# EasyEDA Pro project ProPrj_Quadcopter_2024-12-10.epro, board Quadcopter3.2
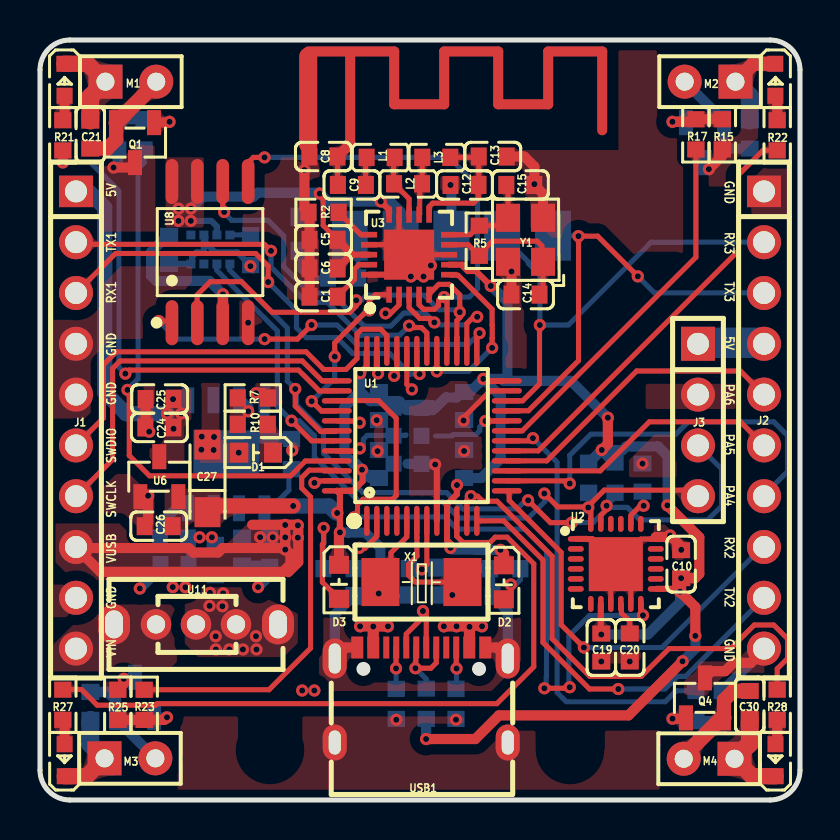
[diagram p7: board, top side]
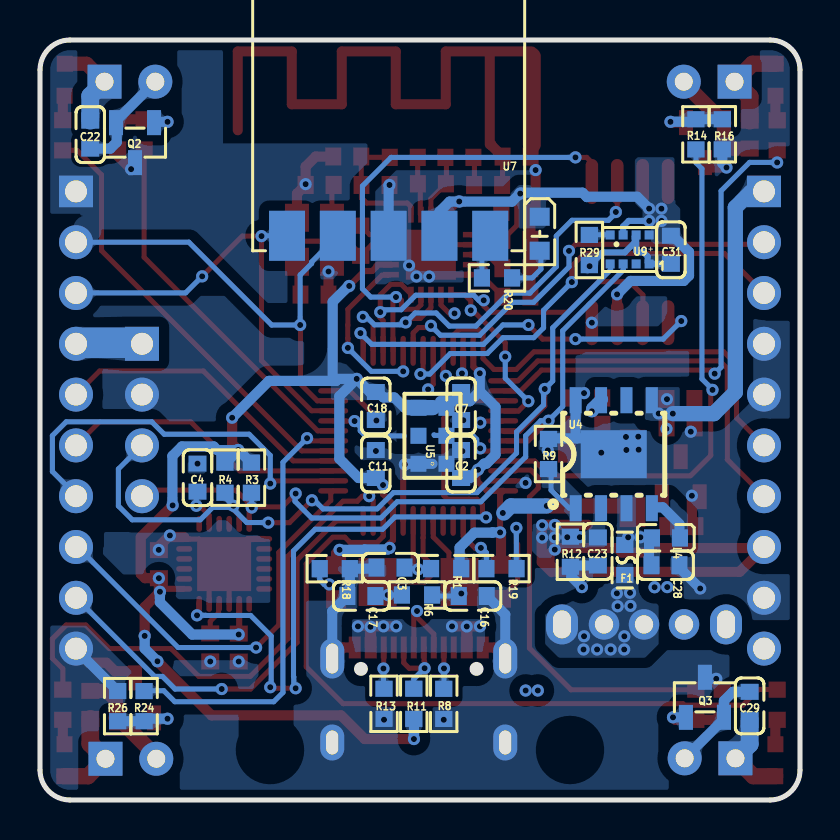
[diagram p8: board, bottom side, seen from below]

Outline 38 x 38 mm; copper layers: Top Layer, VCC, GND, Bottom Layer. Coordinates in mm from the lower left corner of the outline.
Outline path: 0,36.5 0,1.5 arc(0.44,0.44) 1.5,0 36.5,0 arc(37.56,0.44) 38,1.5 38,36.5 arc(37.56,37.56) 36.5,38 1.5,38 arc(0.44,37.56) 0,36.5
Stack: Top Layer 0.035mm 外层铜厚1oz / Dielectric1 0.2104mm 7628 RC49% 8.6mil / VCC 0.035mm / Dielectric4 0.48mm PP er 4.5 / GND 0.035mm / Dielectric5 0.48mm PP er 4.5 / Bottom Layer 0.035mm 外层铜厚1oz

## Design rules (mm)
template: 自定义配置
spacing copperThickness1oz (default): track to track 0.203, other pairs 0.203 to 0.203
spacing copperThickness2oz: track to track 0.203, other pairs 0.152 to 0.3
track width copperThickness1oz (default): min 0.254, default 0.254, max 0.762
track width copperThickness2oz: min 0.203, default 0.254, max 2.54
track width VCC GND: min 0.254, default 0.508, max 1.524
differential pair differentialPair (default): width min 0.127, default 0.254, max 2.54; gap min 0.152, default 0.152
via viaSize (default): diameter min 0.5, default 0.61, max 10; hole min 0.3, default 0.305, max 6.299
net GND uses VCC GND
net 3.3V uses VCC GND
net 5V uses VCC GND
net VBAT uses VCC GND
net VIN uses VCC GND
net VUSB uses VCC GND

## Placement (name value [footprint] x y rotation side)
C1  33nF  [C0603]  14.18 25.17 0 top
C2  100nF  [C0603]  16.95 16.8 90 bottom
C3  100nF  [C0603]  20.48 11.62 0 bottom
C4  2.2nF  [C0603]  30.12 16.12 90 bottom
C5  4.7uF  [C0603]  14.18 28.01 0 top
C6  100nF  [C0603]  14.18 26.59 0 top
C7  100nF  [C0603]  16.94 19.7 270 bottom
C8  1pF  [C0603]  14.17 32.17 180 top
C9  1.5pF  [C0603]  15.6 30.75 0 top
C10  100nF  [C0603]  32.06 11.79 90 top
C11  100nF  [C0603]  21.21 16.8 270 bottom
C12  2.2nF  [C0603]  21.22 30.75 180 top
C13  4.7pF  [C0603]  22.64 32.17 180 top
C14  22pF  [C0603]  24.28 25.27 0 top
C15  22pF  [C0603]  24.02 30.75 0 top
C16  22pF  [C0603]  16.36 10.2 180 bottom
C17  22pF  [C0603]  21.93 10.2 180 bottom
C18  100nF  [C0603]  21.21 19.7 90 bottom
C19  10nF  [C0603]  28.06 7.62 90 top
C20  100nF  [C0603]  29.49 7.63 90 top
C21  4.7uF  [C0603]  2.51 33.27 270 top
C22  4.7uF  [C0603]  35.49 33.27 270 bottom
C23  10uF  [C0603]  10.11 12.42 90 bottom
C24  20uF  [C0603]  5.97 18.63 180 top
C25  1uF  [C0603]  5.98 20.05 0 top
C26  1uF  [C0603]  5.94 13.69 0 top
C27  47uF  [CAP-SMD_L3.2-W1.6-RD]  8.37 16.08 90 top
C28  22uF  [C0603]  6.73 11.74 0 bottom
C29  4.7uF  [C0603]  2.52 4.71 90 bottom
C30  4.7uF  [C0603]  35.49 4.75 90 top
C31  100nF  [C0603]  6.46 27.51 270 bottom
D1  NCD0603G1  [LED0603-RD_1]  10.8 17.37 180 top
D2  NCD0603G1  [LED0603-RD_1]  23.19 10.89 270 top
D3  NCD0603G1  [LED0603-RD_1]  14.95 10.91 270 top
D4  NCD0603G1  [LED0603-RD_1]  13.02 28.31 270 bottom
D5  NCD0603R1  [LED0603-RD_RED]  1.22 36.01 270 top
D6  NCD0603R1  [LED0603-RD_RED]  36.77 36.01 270 top
D7  NCD0603R1  [LED0603-RD_RED]  1.24 1.99 90 top
D8  NCD0603R1  [LED0603-RD_RED]  36.78 1.99 90 top
F1  BSMD0603-050-6V  [F0603]  8.76 12 90 bottom
J1  PZ254V-11-10P  [HDR-TH_10P-P2.54-V-M]  1.8 19 270 top
J2  PZ254V-11-10P  [HDR-TH_10P-P2.54-V-M]  36.2 19 270 top
J3  PZ254V-11-04P  [HDR-TH_4P-P2.54-V-M]  32.9 19 270 top
L1  3.9nH  [L0603]  17.03 32.13 180 top
L2  8.2nH  [L0603]  18.4 30.81 180 top
L3  2.7nH  [L0603]  19.81 32.13 180 top
L4  2.2uH  [L0603]  6.7 13.1 180 bottom
M1  720  [HDR2.54-LI-2P]  4.54 35.92 0 top
M2  720  [HDR2.54-LI-2P]  33.5 35.92 180 top
M3  720  [HDR2.54-LI-2P]  4.5 2.08 0 top
M4  720  [HDR2.54-LI-2P]  33.46 2.06 180 top
Q1  SI2302  [SOT-23-3_L2.9-W1.3-P1.90-LS2.4-BR]  4.75 32.87 90 top
Q2  SI2302  [SOT-23-3_L2.9-W1.3-P1.90-LS2.4-BR]  33.25 32.87 90 bottom
Q3  SI2302  [SOT-23-3_L2.9-W1.3-P1.90-LS2.4-BR]  4.75 5.13 270 bottom
Q4  SI2302  [SOT-23-3_L2.9-W1.3-P1.90-LS2.4-BR]  33.25 5.11 270 top
R1  10kΩ  [R0603]  17.69 11.57 180 bottom
R2  22kΩ  [R0603]  14.18 29.38 180 top
R3  10kΩ  [R0603]  27.43 16.12 90 bottom
R4  10kΩ  [R0603]  28.75 16.12 90 bottom
R5  1MΩ  [R0603]  21.97 27.96 90 top
R6  1MΩ  [R0603]  19.15 10.25 0 bottom
R7  10kΩ  [R0603]  10.64 20.1 0 top
R8  5.1kΩ  [R0603]  17.81 4.81 270 bottom
R9  100kΩ  [R0603]  12.57 17.3 90 bottom
R10  3kΩ  [R0603]  10.64 18.78 180 top
R11  1.5kΩ  [R0603]  19.31 4.81 90 bottom
R12  1kΩ  [R0603]  11.48 12.41 90 bottom
R13  5.1kΩ  [R0603]  20.8 4.81 270 bottom
R14  100Ω  [R0603]  5.2 33.28 270 bottom
R15  100Ω  [R0603]  32.79 33.28 270 top
R16  10kΩ  [R0603]  3.88 33.28 90 bottom
R17  10kΩ  [R0603]  34.12 33.28 90 top
R18  1kΩ  [R0603]  23.26 11.57 0 bottom
R19  1kΩ  [R0603]  14.93 11.57 180 bottom
R20  1kΩ  [R0603]  15.15 26.1 180 bottom
R21  1kΩ  [R0603]  1.14 33.23 270 top
R22  1kΩ  [R0603]  36.86 33.24 270 top
R23  100Ω  [R0603]  5.21 4.76 90 top
R24  100Ω  [R0603]  32.8 4.69 90 bottom
R25  10kΩ  [R0603]  3.89 4.76 270 top
R26  10kΩ  [R0603]  34.12 4.69 270 bottom
R27  1kΩ  [R0603]  1.14 4.76 90 top
R28  1kΩ  [R0603]  36.86 4.76 90 top
R29  10kΩ  [R0603]  10.53 27.5 90 bottom
U1  STM32F103C8T6  [LQFP-48_L7.0-W7.0-P0.50-LS9.0-BL]  19.09 18.21 0 top
U2  MPU-6050  [QFN-24_L4.0-W4.0-P0.50-BL-EP2.7]  28.84 11.75 0 top
U3  Si24R1  [QFN-20_L4.0-W4.0-P0.50-BL-EP]  18.45 27.27 0 top
U4  LGS5500EP  [ESOP-8_L4.9-W3.9-P1.27-LS6.0-TL-EP3.3]  9.31 17.29 90 bottom
U5  -  [BOOT]  19.08 18.21 180 bottom
U6  662K  [SOT-23-3_L2.9-W1.3-P1.90-LS2.4-BR]  5.96 16.16 270 top
U7  VG6328A  [COMM-SMD_VG6328A]  20.56 28.2 180 bottom
U8  W25Q32JVSSIQ  [SOIC-8_L5.3-W5.3-P1.27-LS8.0-BL]  8.5 27.39 0 top
U9  SPL06-001  [SENSOR-SMD_SPL06-001]  8.52 27.53 180 bottom
U11  SS-12D02-VG3  [SW-TH_DEALON_SS-12D02-VGX]  7.8 8.78 0 top
USB1  TYPE-C 16PIN 2MD(073)  [USB-C-SMD_TYPE-C-6PIN-2MD-073]  19.06 5.25 0 top
X1  8MHz  [CRYSTAL-SMD_L5.0-W3.2]  19.07 10.9 0 top
Y1  16MHz  [OSC-SMD_4P-L3.2-W2.5-BL]  24.28 28.01 90 top

## Footprints (pads in the part's own frame, mm; a bottom-side part is the same pattern mirrored in y, then rotated)
BOOT
  rect 0.8x0.8 smd: 1(1.398,1.4) 2(1.398,0) 3(1.398,-1.4) 4(-0.002,1.4) 5(-0.002,0) 6(-0.002,-1.4)
C0603
  rect 0.8x0.9 smd: 1(-0.7,0) 2(0.7,0)
CAP-SMD_L3.2-W1.6-RD
  rect 1.5x1.296 smd: 1(-1.687,0) 2(1.687,0)
COMM-SMD_VG6328A
  rect 1.8x2.5 smd: 1(-5.09,0.01) 2(-2.55,0.01) 3(-0.01,0.01) 4(2.53,0.01) 5(5.07,0.01)
CRYSTAL-SMD_L5.0-W3.2
  rect 1.9x2.4 smd: 1(-2.05,0) 2(2.05,0)
ESOP-8_L4.9-W3.9-P1.27-LS6.0-TL-EP3.3
  rect 1.3x0.6 smd: 1(-2.7,1.905) 2(-2.7,0.635) 3(-2.7,-0.635) 4(-2.7,-1.905) 5(2.7,-1.905) 6(2.7,-0.635) 7(2.7,0.635) 8(2.7,1.905)
  rect 2.4x3.3 smd: 9(0,0)
F0603
  rect 0.806x0.864 smd: 1(-0.753,0) 2(0.753,0)
HDR2.54-LI-2P
  rect 1.7x1.7 hole 0.9: 1(-1.27,0)
  round 1.7 hole 0.9: 2(1.27,0)
HDR-TH_4P-P2.54-V-M
  rect 1.7x1.7 hole 1.1: 1(-3.81,0)
  round 1.7 hole 1.1: 2(-1.27,0) 3(1.27,0) 4(3.81,0)
HDR-TH_10P-P2.54-V-M
  rect 1.575x1.7 hole 1.1: 1(-11.43,0)
  round 1.7 hole 1.1: 2(-8.89,0) 3(-6.35,0) 4(-3.81,0) 5(-1.27,0) 6(1.27,0) 7(3.81,0) 8(6.35,0) 9(8.89,0) 10(11.43,0)
L0603
  rect 0.8x0.864 smd: 1(-0.7,0) 2(0.7,0)
LED0603-RD_1
  rect 0.9x1 smd: 1(-0.85,0) 2(0.85,0)
LED0603-RD_RED
  rect 0.8x0.8 smd: 1(-0.799,-0.004) 2(0.799,0.004)
LQFP-48_L7.0-W7.0-P0.50-LS9.0-BL
  oval 0.27x1.5 smd: 1(-2.75,-4.25) 2(-2.25,-4.25) 3(-1.75,-4.25) 4(-1.25,-4.25) 5(-0.75,-4.25) 6(-0.25,-4.25) 7(0.25,-4.25) 8(0.75,-4.25) 9(1.25,-4.25) 10(1.75,-4.25) 11(2.25,-4.25) 12(2.75,-4.25) 25(2.75,4.25) 26(2.25,4.25) 27(1.75,4.25) 28(1.25,4.25) 29(0.75,4.25) 30(0.25,4.25) 31(-0.25,4.25) 32(-0.75,4.25) 33(-1.25,4.25) 34(-1.75,4.25) 35(-2.25,4.25) 36(-2.75,4.25)
  oval 1.5x0.27 smd: 13(4.25,-2.75) 14(4.25,-2.25) 15(4.25,-1.75) 16(4.25,-1.25) 17(4.25,-0.75) 18(4.25,-0.25) 19(4.25,0.25) 20(4.25,0.75) 21(4.25,1.25) 22(4.25,1.75) 23(4.25,2.25) 24(4.25,2.75) 37(-4.25,2.75) 38(-4.25,2.25) 39(-4.25,1.75) 40(-4.25,1.25) 41(-4.25,0.75) 42(-4.25,0.25) 43(-4.25,-0.25) 44(-4.25,-0.75) 45(-4.25,-1.25) 46(-4.25,-1.75) 47(-4.25,-2.25) 48(-4.25,-2.75)
OSC-SMD_4P-L3.2-W2.5-BL
  rect 1.4x1.2 smd: 1(-1.1,-0.875) 2(1.1,-0.875) 3(1.1,0.875) 4(-1.1,0.875)
QFN-20_L4.0-W4.0-P0.50-BL-EP
  rect 0.28x0.8 smd: 1(-1,-2) 2(-0.5,-2) 3(0,-2) 4(0.5,-2) 5(1,-2) 11(1,2) 12(0.5,2) 13(0,2) 14(-0.5,2) 15(-1,2)
  rect 0.8x0.28 smd: 6(2,-1) 7(2,-0.5) 8(2,0) 9(2,0.5) 10(2,1) 16(-2,1) 17(-2,0.5) 18(-2,0) 19(-2,-0.5) 20(-2,-1)
  rect 2.5x2.5 smd: 21(0,0)
QFN-24_L4.0-W4.0-P0.50-BL-EP2.7
  rect 2.7x2.7 smd: (-0.044,0.044)
  oval 0.8x0.28 smd: 1(-2.045,1.307) 2(-2.045,0.807) 3(-2.045,0.307) 4(-2.045,-0.193) 5(-2.045,-0.693) 6(-2.045,-1.193) 13(1.956,-1.193) 14(1.956,-0.693) 15(1.956,-0.193) 16(1.956,0.307) 17(1.956,0.807) 18(1.956,1.299)
  oval 0.28x0.8 smd: 7(-1.294,-1.943) 8(-0.794,-1.943) 9(-0.294,-1.943) 10(0.205,-1.943) 11(0.706,-1.943) 12(1.206,-1.943) 19(1.206,2.057) 20(0.706,2.057) 21(0.205,2.057) 22(-0.294,2.057) 23(-0.794,2.057) 24(-1.294,2.057)
R0603
  rect 0.806x0.864 smd: 1(-0.753,0) 2(0.753,0)
SENSOR-SMD_SPL06-001
  rect 0.45x0.45 smd: 1(0.975,-0.725) 2(0.325,-0.725) 3(-0.325,-0.725) 4(-0.975,-0.725) 5(-0.975,0.725) 6(-0.325,0.725) 7(0.325,0.725) 8(0.975,0.725)
SOIC-8_L5.3-W5.3-P1.27-LS8.0-BL
  oval 0.63x2.25 smd: 1(-1.905,-3.53) 2(-0.635,-3.53) 3(0.635,-3.53) 4(1.905,-3.53) 5(1.905,3.53) 6(0.635,3.53) 7(-0.635,3.53) 8(-1.905,3.53)
SOT-23-3_L2.9-W1.3-P1.90-LS2.4-BR
  rect 1.25x0.7 smd: 1(1,-0.95) 2(1,0.95) 3(-1,0)
SW-TH_DEALON_SS-12D02-VGX
  round 1.524 hole 0.914: 1(-2,0) 2(0,0) 3(2,0)
  oval 1.6x2 hole 0.9x1.4: 4(4.1,0) 5(-4.1,0)
USB-C-SMD_TYPE-C-6PIN-2MD-073
  rect 0.6x1.1 smd: 1(-3.2,2.375) 2(-2.4,2.375) 11(2.4,2.375) 12(3.2,2.375)
  rect 0.3x1.1 smd: 3(-1.75,2.375) 4(-1.25,2.375) 5(-0.75,2.375) 6(-0.25,2.375) 7(0.25,2.375) 8(0.75,2.375) 9(1.25,2.375) 10(1.75,2.375)
  oval 1.2x2 hole 0.6x1.5: 13(-4.325,1.825) 14(4.325,1.825)
  oval 1.2x1.8 hole 0.6x1.2: 13(-4.325,-2.375) 14(4.325,-2.375)

## Nets
As in the schematic, except:
GND: C1.1 C2.2 C3.2 C4.2 C5.1 C6.1 C7.2 C8.2 C10.2 C11.1 C12.2 C13.1 C14.1 C15.2 C16.2 C17.1 C18.1 C19.1 C20.1 C23.1 C24.2 C25.1 C26.1 C27.2 C28.1 C31.2 D1.2 J1.4 J1.5 J1.9 J2.1 J2.10 J3.2 Q1.3 Q2.3 Q3.3 Q4.3 R2.2 R7.2 R8.2 R9.2 R12.1 R13.2 R16.1 R17.1 R18.1 R25.1 R26.1 R29.1 U1.8 U1.23 U1.35 U1.47 U2. U2.1 U2.9 U2.11 U2.18 U3.8 U3.14 U3.17 U3.20 U3.21 U4.8 U4.9 U5.3 U5.6 U6.1 U7.3 U8.4 U9.1 U9.7 USB1.1 USB1.12 USB1.13 USB1.14 Y1.2 Y1.4
$1N83: C8.1 C9.1

Pads without a net: U1 1 3 4; U2 2 3 4 5 6 7 14 15 16 17 19 21 22; U4 6; U9 2; USB1 3 9

## Via types
v1: diameter 0.61, hole 0.305, Top Layer to Bottom Layer, 161 vias

## Routing (per net, layer and track width the routed paths; a pad name or vN(x,y) marks a point on that pad's centre or on a via; arc(x,y) is an arc through that point)
3.3V: length 143.1
  Top Layer w0.254: v1(13.99,30.32) 14.16,30.15 14.16,28.73 C5.2
  Top Layer w0.305: v1(20.85,15.75) 20.85,15.29 20.35,14.79 20.35,13.97 ; U3.15 17.45,29.51 v1(17.04,29.93) ; C19.2 28.04,8.35 U2.8 ; 20.35,13.96 20.35,12.99 20.52,12.82 v1(20.52,12.61) ; v1(15,13.38) 15,15.3 U1.48 15.48,15.46 15.49,15.47 15.66,15.47 16.13,15.94 16.13,16.48 v1(16.1,16.51) ; 23.11,20.95 22.27,20.95 v1(22.16,21.06) ; U3.7 21.11,26.77 21.18,26.7 21.18,26.66 21.39,26.45 21.79,26.45 v1(22.54,25.7) ; 32.06,10.85 31.77,10.56 30.82,10.56 ; v1(16.01,21.34) 16.33,21.66 16.33,22.43 ; U3.18 15.62,27.27
  Top Layer w0.381: C5.2 15.62,27.27 15.56,27.27 C6.2
  Top Layer w0.508: v1(32.77,8.21) 32.77,9.65 v1(32,10.41) 32.06,10.47 32.06,10.85 ; v1(9.15,25.28) 9.15,23.87 U8.3 ; v1(19.3,3.05) 21.77,3.05 22.95,4.23 29.42,4.23 v1(32.13,6.94) ; v1(31.37,14.73) 32.96,13.14 32.96,11.3 32.75,11.09 v1(32.06,11.09) ; v1(28.09,17.5) 28.39,17.81 v1(28.39,19.11) ; D2.1 23.19,12.33 v1(23.02,12.51) ; v1(15,13.38) 14.95,13.33 D3.1
  Top Layer w0.762: 8.37,14.39 8.68,14.7 v1(12.66,14.7)
  VCC w0.762: v1(12.66,14.7) 12.48,14.7 11.69,15.5 11.69,16.87 9.15,19.41 v1(9.15,25.28)
  Bottom Layer w0.305: v1(7.54,28.95) 8.57,28.95 8.84,28.68 U9.6
  Bottom Layer w0.508: 19.78,19.62 20.29,20.13 20.83,20.13 21.14,20.44 ; 23.2,20.95 23.37,21.13 23.37,24.9 22.57,25.7 22.54,25.7 v1(22.54,25.7) ; 23.2,20.95 23.1,21.06 v1(22.16,21.06) ; 23.2,20.95 26.55,20.95 v1(28.39,19.11) ; U7.4 18.03,29.41 17.52,29.92 14.4,29.92 13.99,30.33 ; 28.07,17.49 28.07,17.49 28.08,17.49 ; 28.07,17.49 28.08,17.49 ; 28.07,17.49 27.46,16.87 R3.2 ; 28.07,17.49 28.69,16.87 R4.2 ; v1(22.16,21.06) 21.5,20.39 21.2,20.39 ; v1(22.16,21.06) 23.03,20.19 23.03,17.06 22.07,16.1 C11.2 20.86,15.75 v1(20.85,15.75) ; v1(32,10.41) 32,9.89 30.39,8.27 v1(28.06,8.27) ; 28.08,17.49 v1(28.09,17.5) ; 28.08,17.49 29.13,17.49 29.31,17.68 30.9,17.68 31.38,17.2 31.38,14.78 31.37,14.77 v1(31.37,14.73) ; 16.01,20.44 16.51,19.94 17.99,19.94 ; 16.01,20.44 15.22,19.65 15.22,17.27 15.67,16.82 15.79,16.82 v1(16.1,16.51) 16.51,16.1 C2.1 ; 16.01,20.44 v1(16.01,21.34) ; v1(19.3,3.05) 19.3,4.05 R11.1 ; 13.99,30.33 13.96,30.36 10.87,30.36 10.66,30.15 10.64,30.16 8.14,30.16 v1(7.54,29.57) ; 13.99,30.33 v1(13.99,30.32) ; v1(23.02,12.51) 21.79,12.51 21.77,12.53 20.6,12.53 20.57,12.55 ; v1(15,13.38) 15.37,13.38 15.38,13.37 16.27,13.37 17.02,12.62 17.02,11.65 R1.2 ; C31.1 6.41,28.26 5.55,27.4 5.55,26.22 5.82,25.95 8.48,25.95 v1(9.15,25.28) ; v1(32.13,6.94) 32.77,7.57 v1(32.77,8.21)
  Bottom Layer w0.762: v1(12.66,14.7) 14.46,14.7 14.81,14.35 ; 19.6,19.62 18.36,19.62
  vias: v1(6.93,29.57) v1(6.92,28.95) v1(14.86,14.35)
5V: length 54.9
  VCC w1.016: 7.28,19.32 7.25,19.32 ; 7.25,19.32 6.95,19.61 6.95,25.45 10.2,28.7 24.68,28.72 30.59,22.81 32.65,22.81 32.77,22.93 ; 7.25,19.32 v1(6.36,19.32) ; 32.9,22.81 32.9,22.93
  Bottom Layer w0.762: v1(6.36,19.32) 4.31,19.32 3.23,20.39 3.23,29.63 2.47,30.39 1.85,30.39 1.81,30.43
  Bottom Layer w1.524: 36.21,22.86 32.9,22.86 32.86,22.82
  vias: v1(6.65,20.04) v1(6.68,18.56) v1(7.07,19.33)
GND: length 86.7
  Top Layer w0.254: U2.9 28.54,11.54 28.79,11.79 ; U2.11 29.54,11.04 28.79,11.79 ; U3.14 17.95,27.77 ; 17.95,27.77 U3.21 U3.8 ; 17.95,27.77 U3.17 ; v1(13.72,15.86) 13.82,15.96 U1.47 ; 23.14,20.46 22.51,20.46 21.16,19.11 21.16,19.02 ; 28.79,11.79 30.04,13.05 U2.18
  Top Layer w0.305: U1.35 16.84,21.39 v1(16.9,21.33) ; v1(19.76,16.78) 19.84,16.69 19.84,13.96 ; U3.20 17.45,26.27 U3.21 ; 26.81,13.05 27.33,13.05 27.34,13.05 27.6,13.05 28.67,11.98
  Top Layer w0.508: J2.10 36.2,7.51 35.55,6.86 34.68,6.86 34.26,6.44 33.58,6.44 Q4.3 ; 3.89,5.51 4.19,5.81 v1(4.19,6.06) ; C26.1 5.41,13.86 v1(5.41,15.21) 5.36,15.16 U6.1 ; Q1.3 4.5,31.62 v1(3.68,31.62) ; 13.48,26.59 C5.1 13.48,29.33 R2.2 13.22,29.59 v1(13.22,31.5) ; R17.1 34.12,32.21 v1(33.44,31.54) ; USB1.12 22.84,7.62 USB1.14 ; C6.1 13.48,25.17 ; Y1.2 25.15,30.32 C15.2 v1(24.72,30.79) 24.72,31.67 24.21,32.17 C13.1 ; v1(32.06,12.51) 32.06,12.67 v1(31.5,13.23) 31.43,13.15 30.79,13.15 ; C25.1 5.28,18.64 C24.2 ; Y1.4 23.57,26.74 v1(23.57,26.42) C14.1 ; v1(10.8,20.34) 11.15,20.34 R7.2 ; USB1.1 15.29,7.62 USB1.13
  Bottom Layer w0.305: C31.2 7.53,26.81 U9.1 7.61,26.87 7.61,27.17 7.82,27.38 8.12,27.38 8.19,27.45 U9.7 8.26,28.18 8.26,27.88 8.76,27.38 9.86,27.38 10.5,26.74 R29.1
  Bottom Layer w0.508: USB1.14 23.39,9.44 C17.1 22.51,10.32 22.51,11.57 21.23,11.57 C3.2 ; 11.16,18.08 11.22,18.14 U4.8 ; 11.16,18.08 10.74,18.08 9.98,17.32 ; 11.16,18.08 12.52,18.08 ; C16.2 14.74,9.27 USB1.13 ; R26.1 36.2,7.53 J2.10 ; 11.41,11.72 C23.1 ; v1(10.9,10.64) 11.43,11.17 11.43,11.65 ; Q3.3 4.68,6.06 v1(4.19,6.06) ; U7.3 20.57,30.71 v1(20.53,30.75) ; R9.2 12.61,18.02 v1(12.61,17.48) ; C28.1 6.03,11.61 v1(4.99,10.57) ; 11.48,11.66 11.46,11.67 ; v1(3.68,31.62) 3.88,31.83 3.88,32.53 ; 18.38,16.81 19.78,16.81
  vias: v1(5.46,18.42) v1(8.09,18.17) v1(8.07,17.52) v1(8.7,18.15) v1(8.68,17.5) v1(9.94,17.37) v1(10.41,23.86) v1(10.52,26.69) v1(16.83,18.99) v1(16.88,17.44) v1(17.81,4.01) v1(18.54,26.17) v1(19.18,26.17) v1(19.55,26.72) v1(20.8,4.01) v1(21.18,18.97) v1(21.21,17.45) v1(28.06,6.92) v1(29.49,6.93) v1(30.12,16.82)
VBAT: length 124.4
  Top Layer w0.711: M2.1 35.67,36.81 D6.1
  Top Layer w0.813: D7.1 2.33,1.19 M3.1 ; 36.78,1.19 35.6,1.19 M4.1 ; D5.1 2.38,36.81 M1.1
  Top Layer w0.889: C30.1 35.49,2.82 M4.1 ; M1.1 2.51,35.16 C21.1
  VCC w0.889: 34.4,2.91 34.4,35.54 M2.1 ; 34.29,5.75 34.27,5.73 31.56,5.73
  VCC w1.016: 3.24,2.34 3.24,3.67 4.81,5.24 23.6,5.24 24.37,4.47 30.49,4.47 31.65,5.64 ; 3.3,35.63 3.33,35.61 3.54,35.61 4.69,34.46 4.69,22.67 5.39,21.97 5.39,20.08 4.39,19.08 4.39,14.66 6.03,13.01 7.44,13.01 7.47,13.04 ; 13.44,5.32 13.41,5.36 13.41,9.61 11.36,11.66 9.45,11.66 v1(7.98,13.14)
  Bottom Layer w0.508: 7.58,13.14 7.58,13.07 7.55,13.04 7.55,11.87 7.45,11.77
  Bottom Layer w0.889: M3.1 2.52,2.79 C29.1 ; C22.1 35.49,35.2 M2.1
  vias: v1(6.64,10.64) v1(7.27,10.64) v1(8.59,13.14) v1(13.11,5.47) v1(13.72,5.47)
BOOT0: length 4
  Top Layer w0.254: v1(15.99,17.58) 15.85,17.44 14.81,17.44
  Bottom Layer w0.254: 18.3,18.26 18.27,18.23 16.36,18.23 16.17,18.04 16.17,17.76 v1(15.99,17.58)
BOOT1: length 4
  Top Layer w0.254: v1(22.27,18.95) 23.37,18.95
  Bottom Layer w0.254: v1(22.27,18.95) 21.99,18.66 21.99,18.46 21.79,18.27 20.66,18.27 20.6,18.21 19.79,18.21
CE: length 8.8
  Top Layer w0.254: v1(14.74,22.17) 14.74,22.17 14.74,22.86 16.28,24.4 16.38,24.4 v1(16.46,24.48) ; v1(13.58,19.94) 13.76,19.76 13.76,19.76 14.08,19.44 14.78,19.44 ; v1(16.46,24.48) 16.46,24.96 16.77,25.27 17.44,25.27 ; v1(16.46,24.48) 16.43,24.52
  Bottom Layer w0.254: v1(13.58,19.94) 14.74,21.09 14.74,22.16 v1(14.74,22.17)
CS1: length 9.1
  Top Layer w0.254: 17.94,25.28 17.95,25.28 17.95,24.75 17.47,24.26 17.37,24.26 17.29,24.34 17.28,24.34 v1(17.27,24.33) ; v1(15.99,18.86) 15.91,18.94 14.87,18.94
  VCC w0.254: v1(17.27,24.33) 15.37,22.43 15.37,19.48 v1(15.99,18.86)
CS2: length 19
  Top Layer w0.254: 21.84,22.48 21.84,23.2 v1(21.98,23.34) ; 6.64,23.99 6.6,23.95 v1(5.94,23.95) ; v1(11.23,23.05) 12.87,23.05 v1(13.58,23.75)
  Bottom Layer w0.254: v1(13.58,23.75) 14.86,23.75 15.83,22.78 21.41,22.78 v1(21.98,23.34) ; v1(11.23,23.05) 6.84,23.05 v1(5.94,23.95)
LED1: length 24.3
  Top Layer w0.254: U1.38 13.96,20.46 12.93,21.5 4.44,21.5 v1(4.27,21.32) ; R21.2 1.14,31.88 v1(1.14,31.88)
  Bottom Layer w0.254: v1(4.27,21.32) 3.95,21.64 3.95,30.46 2.52,31.88 1.15,31.88 v1(1.14,31.88)
LED2: length 22
  Top Layer w0.254: R22.2 36.15,32.48 34.93,31.26 34.93,27.47 24.91,17.46 U1.17
LED3: length 35.2
  Top Layer w0.254: R27.2 1.15,5.53 2.07,5.53 2.86,4.74 5.78,4.74 5.85,4.82 22.84,4.82 24.69,6.66 24.69,11.81 23.36,13.14 22.76,13.14 22.5,12.88 21.15,12.88 20.84,13.19 20.84,13.95 U1.10
LED4: length 27.4
  Top Layer w0.254: R28.2 36.86,6.56 37.38,7.08 37.38,8.06 36.69,8.75 35.71,8.75 34.53,7.57 31.45,7.57 30.06,6.18 27.49,6.18 25.6,8.07 25.6,12.19 22.85,14.94 22.13,14.94 21.88,15.19 v1(21.54,15.19) 21.34,14.99 U1.11
MISO: length 21.3
  Top Layer w0.254: 20.85,22.4 20.85,23.14 20.84,23.15 20.84,23.97 21.01,24.13 21.01,24.38 v1(20.99,24.39) 20.99,25.26 20.46,25.78 19.94,25.78 19.44,25.29 19.44,25.28 ; 7.81,23.87 7.85,23.87 7.86,23.88 7.86,25.25 8.52,25.92 10.08,25.92 11.61,24.39 15.49,24.39 15.81,24.71 v1(15.81,24.98)
  Bottom Layer w0.254: v1(20.99,24.39) 20.87,24.51 19.94,24.51 19.21,25.24 16.32,25.24 16.06,24.98 v1(15.81,24.98)
MOSI: length 24.9
  Top Layer w0.254: 20.35,22.43 20.35,25 ; 10.46,30.91 10.46,31.92 10.67,32.13 v1(11.23,32.13) ; 18.96,25.27 18.95,25.26 18.95,24.76 19.18,24.54 19.73,24.54 19.93,24.73 19.93,24.98 20.07,25.14 20.2,25.14 ; 20.21,25.14 v1(20.2,25.15)
  Bottom Layer w0.254: v1(11.23,32.13) 20.45,32.13 21.88,30.7 21.88,25.56 21.47,25.15 v1(20.2,25.15)
MPU_INT: length 36.2
  Top Layer w0.254: 14.74,19.97 16.93,19.97 17.81,19.09 17.81,15.22 17.63,15.04 16.55,15.04 16.55,15.04 16.15,15.04 15.88,14.76 15.88,14.37 15.65,14.14 ; v1(25.22,5.59) 26.43,5.59 v1(26.49,5.64) ; v1(30.15,9.23) 30.13,9.23 30.06,9.3 30.06,9.82 30.05,9.83 30.05,9.92
  Bottom Layer w0.254: v1(30.15,9.23) 29.72,9.23 29.71,9.23 27.47,9.23 26.44,8.2 26.44,5.69 v1(26.49,5.64) ; v1(15.7,14.13) 15.72,14.15 20.25,14.15 20.87,13.54 24.24,13.54 25.32,12.45 25.32,6.17 25.31,6.16 25.31,5.68 v1(25.22,5.59)
NRF_IRQ: length 9.1
  Top Layer w0.254: v1(19.84,21.43) U1.29 ; v1(22.61,22.61) 22.61,23.08 22.61,23.08 22.61,23.74 22.61,23.75 22.61,24.54 20.9,26.24 20.61,26.24 20.58,26.27 U3.6
  Bottom Layer w0.254: 22.61,22.61 21.43,21.43 v1(19.84,21.43)
OSC_IN: length 5.2
  Top Layer w0.254: X1.1 17.05,10.9 17.55,11.4 17.55,12.36 18.34,13.15 18.34,13.92 18.34,13.93 U1.5
  Bottom Layer w0.254: R6.1 18.34,10.2 17.06,10.2 16.94,10.32
  vias: v1(16.94,10.33)
OSC_OUT: length 7.1
  Top Layer w0.254: X1.2 18.77,10.9 18.43,11.24 18.43,11.77 18.85,12.19 18.85,13.11 18.84,13.12 U1.6
  Bottom Layer w0.254: C17.2 21.18,10.25 v1(20.61,10.25) R6.2
PA4: length 20
  Top Layer w0.254: U1.14 26.35,15.96 v1(26.49,15.82)
  Bottom Layer w0.254: J2.7 36.2,15.24 37.38,16.42 37.38,18.22 36.69,18.91 32.41,18.91 31.79,18.29 27.54,18.29 26.49,17.23 v1(26.49,15.82)
PA5: length 14.4
  Top Layer w0.254: J2.6 35.02,18.91 30.47,18.91 28.01,16.46 U1.15
PA6: length 15.2
  Top Layer w0.254: U1.16 25.34,16.96 29.83,21.45 35.02,21.45 J2.5
PC13: length 3.1
  Top Layer w0.254: U1.2 16.84,13.18 16.23,12.57 15.99,12.57 v1(15.96,12.61)
  Bottom Layer w0.254: 15.68,11.57 15.68,12.36 15.92,12.61 v1(15.96,12.61)
PWM1: length 26.8
  Top Layer w0.254: 14.86,16.95 13.27,16.95 12.53,16.21 5.48,16.21 4.46,17.22 4.46,20.41 4.37,20.5
  Bottom Layer w0.254: v1(4.38,20.5) 4.38,20.53 4.9,21.05 4.9,31.56 5.21,31.86 R14.2
PWM2: length 18.4
  Top Layer w0.254: R15.2 32.79,27.14 24.11,18.46 U1.19
PWM3: length 19.8
  Top Layer w0.254: U1.46 14.81,16.49 13.46,16.49 13.09,16.12 13.09,15.59 13.53,15.15 13.53,7.59 11.45,5.51 R23.2
PWM4: length 21.9
  Top Layer w0.254: U1.18 24.51,17.96 v1(24.65,18.09)
  Bottom Layer w0.254: v1(24.65,18.09) 25.85,16.89 25.85,5.38 26.31,4.91 31.26,4.91 31.81,5.46 32.75,5.46 32.76,5.45
RST: length 4.2
  Top Layer w0.254: v1(19.09,11.53) 19.09,11.54 19.34,11.78 U1.7
  Bottom Layer w0.254: 19.57,11.57 19.06,11.57 ; 19.57,11.57 19.73,11.57 19.78,11.62 19.62,11.62 19.57,11.57 ; 19.06,11.57 R1.1 ; 19.06,11.57 v1(19.09,11.53)
RXD1: length 22.7
  Top Layer w0.254: v1(11.41,25.9) 11.41,26.7 10.78,27.33 3.78,27.33 J1.3 ; U1.31 18.84,22.43 18.84,22.42 18.84,21.42 18.97,21.3 v1(18.98,21.3)
  Bottom Layer w0.254: v1(11.41,25.9) 12.82,24.48 12.82,23.61 13.31,23.12 14.84,23.12 15.64,22.32 17.49,22.32 18.51,21.3 v1(18.98,21.3)
RXD2: length 20.5
  Top Layer w0.254: v1(27.2,7.62) 26.06,8.76 26.06,12.38 23.46,14.98 23.46,15.34 U1.13
  Bottom Layer w0.254: J2.8 36.12,12.65 31.09,7.62 v1(27.2,7.62)
RXD3: length 23.1
  Top Layer w0.254: U1.22 23.36,19.96 ; v1(24.99,23.75) 24.98,23.73 24.98,20.8 24.13,19.96 23.36,19.96
  Bottom Layer w0.254: U7.2 24.42,26.9 24.42,26.83 24.99,26.25 v1(24.99,23.75) 26.42,23.75 30.56,27.89 J2.2
SCK: length 22.5
  Top Layer w0.254: v1(19.72,23.88) 19.52,24.08 18.99,24.08 18.45,24.61 U3.3 ; v1(21.86,24.16) 21.68,24.16 21.34,23.82 21.34,22.46 ; U8.6 9.14,29.47 v1(9.21,29.4)
  Bottom Layer w0.254: v1(21.86,24.16) 21.68,24.16 21.28,23.76 19.84,23.76 v1(19.72,23.88) 19.25,24.35 18.19,24.35 17.54,23.7 16.21,23.7 14.56,25.34 13.51,25.34 12.19,26.67 12.19,28.2 11.4,28.98 9.58,28.98 9.15,29.42 9.09,29.42
SCL: length 43
  Top Layer w0.254: 14.83,18.46 14.79,18.42 14.03,18.42 12.76,19.7 v1(12.76,20.55) ; v1(26.59,13.87) 25.52,13.87 v1(24.41,14.99) ; v1(28.33,14.71) 28.33,14.52 28.04,14.23 U2.23
  Bottom Layer w0.254: R4.1 28.75,15.13 28.33,14.71 ; 28.4,14.63 29.37,14.63 29.99,14.01 33.39,14.01 34.08,14.7 34.08,16.55 J3.3 ; 28.4,14.63 28.4,14.71 v1(28.33,14.71) ; 28.4,14.63 28.4,14.61 27.66,13.87 26.59,13.87 v1(26.59,13.87) ; v1(24.41,14.99) 24.28,14.99 23.85,14.56 21.14,14.56 20.33,15.37 16.15,15.37 14.17,17.34 14.17,18.4 12.82,19.75 12.82,20.37 12.76,20.42 v1(12.76,20.55) 12.36,20.95 12.36,23.61 9.47,26.5 9.47,26.84
SDA: length 37.8
  Top Layer w0.254: v1(27.41,14.62) 27.41,14.69 28.21,15.49 32.6,15.49 J3.4 ; U2.24 27.54,14.5 ; v1(12.58,18.96) 13.59,17.96 14.66,17.96 14.67,17.97 ; 27.38,14.65 25.89,14.65 v1(25.22,15.32)
  Bottom Layer w0.254: v1(27.41,14.62) 27.41,15.22 27.43,15.24 ; v1(25.22,15.32) 25.25,15.29 25.25,14.93 24.42,14.1 20.95,14.1 20.14,14.91 15.96,14.91 13.72,17.16 13.72,18.21 12.96,18.96 v1(12.58,18.96) 11.87,19.67 11.87,23.46 8.83,26.5 8.83,26.86
SWCLK: length 18.9
  Top Layer w0.254: J1.7 3.63,17.02 3.63,21.58 4,21.95 13.11,21.95 14.11,20.96 U1.37
SWDIO: length 21.9
  Top Layer w0.254: J1.6 3.18,19.11 3.18,21.77 3.81,22.41 13.3,22.41 14.19,21.53 15.3,21.53 15.85,22.07 15.85,23.3 16.09,23.54 17.03,23.54 17.34,23.23 U1.34
TXD1: length 21.2
  Top Layer w0.254: U1.30 19.34,23.36 19.08,23.62 18.55,23.62 v1(18.45,23.72) ; J1.2 1.91,27.78 11.22,27.78 v1(11.55,27.46)
  Bottom Layer w0.254: v1(18.45,23.72) 17.98,23.24 16.02,23.24 14.37,24.89 13.32,24.89 11.55,26.65 v1(11.55,27.46)
TXD2: length 22.1
  Top Layer w0.254: U1.12 23.19,13.96 25.15,12 25.15,7.88 27.48,5.55 v1(28.92,5.55)
  Bottom Layer w0.254: v1(28.92,5.55) 31.25,5.55 31.88,6.18 32.27,6.18 J2.9
TXD3: length 22.6
  Top Layer w0.254: v1(29.89,26.18) 27.88,28.19 v1(26.92,28.19) ; 26.88,28.19 26.93,28.15 26.93,21.97 24.42,19.46 23.33,19.46 23.31,19.45 23.28,19.45
  Bottom Layer w0.254: U7.1 26.91,28.21 v1(26.92,28.19) ; v1(29.89,26.18) 30.72,25.36 36.18,25.36
USBDM: length 17.8
  Top Layer w0.254: v1(18.59,20.53) 18.34,20.78 U1.32 ; 18.31,7.63 18.31,8.3 19.15,9.14 v1(19.15,9.45) 19.31,9.29 19.31,7.63
  VCC w0.254: v1(18.59,20.53) 18.34,20.28 18.34,9.85 18.75,9.45 v1(19.15,9.45)
USBDP: length 20.6
  Top Layer w0.254: 19.81,7.63 19.81,6.86 19.54,6.59 v1(18.77,6.59) 18.77,6.92 18.79,6.94 18.79,7.61 18.81,7.63 ; U1.33 17.84,21.34 v1(17.71,21.21)
  VCC w0.254: v1(18.77,6.59) 18.78,6.6 18.78,8.77 17.88,9.66 17.88,21.03 v1(17.71,21.21)
  Bottom Layer w0.254: v1(18.77,6.59) 19.31,6.05 R11.2
VUSB: length 34.4
  Top Layer w0.508: 1.83,12.6 3.02,11.41 12.14,11.41 12.52,11.79 12.52,12.3 12.26,12.56 ; 1.83,12.6 1.69,12.6 ; 1.83,12.6 7.44,12.6 7.66,12.37 8.91,12.37 9.13,12.6 12.26,12.6 12.26,13.75 ; v1(17.4,8.68) 17.39,8.68 v1(16.66,8.68) 16.66,8.68 v1(16,8.68) ; 21.45,8.68 v1(20.83,8.68) v1(20.19,8.68) ; 21.45,8.62 21.47,8.64 21.54,8.71 22.1,8.71 ; 12.41,11.39 12.91,11.89 12.91,13.73 ; 12.92,13.76 10.61,13.76
  Top Layer w0.559: 16.66,7.63 v1(16.66,8.68) ; 21.46,7.63 21.47,7.65 21.47,8.62
  vias: v1(11.01,13.14) v1(11.64,13.14) v1(12.26,13.75) v1(12.26,13.14) v1(12.26,12.52) v1(12.89,13.73) v1(12.89,13.12) v1(21.47,8.66) v1(22.1,8.68)
$1N42: length 1.7
  Top Layer w0.254: C20.2 29.49,8.93 29.07,9.35 29.07,9.77 U2.10
$1N59: length 1.3
  Top Layer w0.508: 36.86,33.99 36.86,35.12 D6.2
$1N81: length 2
  Top Layer w0.254: U3.16 16.05,28.27 R2.1
$1N82: length 2.6
  Top Layer w0.254: U3.19 15.95,26.77 15.72,26.54 15.72,26.04 14.88,25.19 C1.2
$1N83: length 40.3
  Top Layer w0.254: C9.1 14.87,30.78 C8.1
  Top Layer w0.5: 15.51,32.78 15.51,37.18 ; 13.41,37.43 17.71,37.43 17.71,34.79 20.21,34.79 20.21,37.43 22.91,37.43 22.91,34.79 25.41,34.79 25.41,37.43 28.11,37.43 28.11,33.49
  Top Layer w0.508: C8.1 15.42,32.72 15.42,32.75 15.46,32.8
  Top Layer w0.9: 13.41,32.78 13.41,37.18
$1N85: length 7.8
  Top Layer w0.254: U3.9 21.41,27.77 21.97,27.21 21.97,27.29 22.62,27.94 24.86,27.94 25.09,27.7 25.09,26.97 Y1.1 25.15,25.45 C14.2
$1N86: length 5
  Top Layer w0.254: U3.10 21.51,28.27 R5.2 23.01,28.72 Y1.3 23.4,30.67 C15.1
$1N88: length 5.2
  Bottom Layer w0.508: C29.2 3.35,5.41 3.8,4.96 Q3.2 3.8,4.05 M3.2
$1N90: length 5.2
  Bottom Layer w0.508: C22.2 34.49,32.57 34.16,32.89 34.16,33.83 34.2,33.87 ; M2.2 34.2,33.95
$1N91: length 5.2
  Top Layer w0.711: Q1.2 3.81,33.86 3.81,33.02 3.36,32.57 C21.2
  Top Layer w0.762: M1.2 5.81,35.86 3.81,33.86
$1N122: length 3.2
  Top Layer w0.254: U3.13 18.45,30.06 L2.2 17.68,30.84 17.68,32.13
$1N123: length 2.9
  Top Layer w0.254: U3.12 18.98,29.3 18.98,30.69 L2.1 19.12,30.82 L3.2
$1N124: length 6.6
  Top Layer w0.254: L3.1 21.89,32.13 C13.2 21.94,30.76 C12.1 21.93,30.75 21.93,30.11 21.66,29.84 19.63,29.84 19.45,29.67 U3.11
$1N1531: length 3.4
  Top Layer w0.508: v1(6.48,33.91) 6.44,33.87 Q1.1
  Bottom Layer w0.508: 3.89,34.04 R14.1 5.33,33.91 v1(6.48,33.91)
$1N1536: length 2
  Top Layer w0.254: U2.20 29.54,13.81 29.54,13.81 29.54,14.23 30,14.69 30.16,14.69 v1(30.18,14.71)
  Bottom Layer w0.254: v1(30.18,14.71) 30.18,15.36 C4.1
$1N1557: length 1.4
  Top Layer w0.254: C9.2 16.28,30.77 16.28,32.13
$1N1588: length 3.2
  Top Layer w0.508: R17.2 R15.1 32.67,33.91 v1(31.62,33.91)
  Bottom Layer w0.508: v1(31.62,33.91) 32.26,33.91 Q2.1
$1N1589: length 3.2
  Top Layer w0.508: v1(6.35,4.13) 6.22,4.01 R23.1 R25.2
  Bottom Layer w0.508: Q3.1 v1(6.35,4.13)
$1N1590: length 3.2
  Top Layer w0.508: Q4.1 32.25,4.06 v1(31.62,4.06)
  Bottom Layer w0.508: v1(31.62,4.06) 32.67,4.06 R24.1 R26.2
$1N24218: length 2
  Top Layer w0.254: D2.2 23.54,10.38 v1(23.54,10.78)
  Bottom Layer w0.254: R18.2 24.01,11 23.79,10.78 v1(23.54,10.78)
$1N25042: length 1
  Bottom Layer w0.254: 10.53,28.25 10.52,28.26 9.49,28.26
$1N25237: length 2.3
  Bottom Layer w0.254: R20.1 15.9,27.8 U7.5
$1N92283: length 5.3
  Top Layer w0.711: Q4.2 34.2,4.99 34.66,5.45 C30.2
  Top Layer w0.762: M4.2 32.19,2.19 34.06,4.06 34.15,4.06 Q4.2
$1N93213: length 2.3
  Bottom Layer w0.508: 6.03,13.13 6.03,13.8 6.86,14.63 7.28,14.63
$1N93916: length 2.7
  Bottom Layer w0.254: U4.1 11.54,14.59 12.45,15.49 12.45,16.42 R9.1
$1N94129: length 0.8
  Bottom Layer w0.635: 9.91,20.03 10.37,19.57 10.37,19.46
  vias: v1(10.41,19.44)
$1N102959: length 6
  Top Layer w0.254: v1(14.18,13.6) 14.18,12.85 14.12,12.78 14.12,10.89 D3.2
  Bottom Layer w0.254: R19.2 14.18,11.58 v1(14.18,13.6)
$1N103033: length 2.6
  Bottom Layer w0.254: R20.2 13.39,26.1 12.95,26.54 12.95,27.4 D4.2
$1N103551: length 1.3
  Top Layer w0.508: R28.1 36.86,2.87 D8.2
$1N103755: length 1.3
  Top Layer w0.508: R21.1 1.23,34.07 D5.2
$1N103859: length 1.3
  Top Layer w0.508: D7.2 1.23,3.92 R27.1
$1N175673:
  vias: v1(8.5,10.36) v1(8.48,9.7) v1(8.78,8.18) v1(8.79,7.53) v1(9.12,9.69) v1(9.16,10.33) v1(9.47,7.53) v1(10.15,7.53) v1(10.8,8.19) v1(10.82,7.53)
$1N176106: length 2.1
  Top Layer w0.254: 17.81,7.63 17.8,7.62 v1(17.8,6.58)
  Bottom Layer w0.254: v1(17.8,6.58) 17.8,5.57 R8.1
$1N176118: length 2.1
  Top Layer w0.254: 20.81,7.63 20.81,6.59 v1(20.83,6.57)
  Bottom Layer w0.254: R13.1 20.83,5.59 v1(20.83,6.57)

## Copper pours and planes (outline as drawn; the poured copper is in the pictures)
3.3V on Top Layer: 14.46,28.46 15.26,28.46 15.26,26.1 14.46,26.1
3.3V on Top Layer: 6.23,15.8 9.03,15.8 9.03,13.23 6.23,13.23
3.3V on Top Layer: 6.28,32.14 8.19,32.14 8.19,28.63 6.28,28.63
3.3V on Bottom Layer: 14.48,30.33 14.05,30.75 13.5,30.75 12.84,30.1 12.7,30.1 12.7,28.7 12.83,28.58 14.18,28.58 14.18,29.69 14.4,29.92 14.4,30.02 14.48,30.1
3.3V on Bottom Layer: 26.95,17.27 29.21,17.27 29.21,16.46 26.95,16.46
3.3V on Bottom Layer: 20.84,20.78 21.94,21.88 23.46,21.88 23.46,19.99 21.01,19.99 20.96,19.94 20.84,20.05
3.3V on Bottom Layer: 6.28,32.14 8.12,32.14 8.25,32 8.25,29.84 7.87,29.46 7.87,27.97 7.72,27.82 5.99,27.82 5.99,29.57 6.22,29.81 6.22,29.97 6.28,30.03
3.3V on VCC: 6.1,37.47 32.89,37.47 32.89,7.62 6.1,7.62
5V on Top Layer: 6.25,20.55 7.57,20.55 7.57,17.25 6.84,16.52 5.47,16.52 5.47,17.81 6.26,19.15
5V on Bottom Layer: 6.01,20.65 7.75,20.65 7.75,18.96 6.01,18.96
GND on Top Layer: 0,38 38,38 38,0 0,0
GND on Bottom Layer: 0,38 38,38 38,0 0,0
GND on GND: 0.26,37.74 37.74,37.74 37.74,0.26 0.26,0.26
VBAT on Bottom Layer: 7,15.23 9.23,15.23 9.23,11.28 7,11.28
VBAT on VCC: 0,7.66 38,7.66 38,0 0,0
VBAT on VCC: 0,37.97 6.03,37.97 6.03,11.03 0,11.03
VBAT on VCC: 0,13.97 9.36,13.97 18.08,5.24 17.28,4.44 0.25,4.44 0,4.7
VBAT on VCC: 32.43,6.18 33.96,7.71 34.12,7.71 34.12,4.06 34.13,4.04 34.01,4.04 32.74,5.32 32.49,5.32 32.43,5.38
VBAT on VCC: 32.74,38 38,38 38,0 32.74,0
VIN on Top Layer: 0.55,6.43 6.36,6.43 6.84,6.91 6.84,9.46 6.52,9.78 2.67,9.78 0.55,7.66
VUSB on Top Layer: 0.77,13.83 3.97,13.83 4.88,12.92 9.46,12.92 10.86,14.32 13.24,14.32 13.4,14.16 13.4,12.27 12.12,10.99 1.67,10.99 0.77,11.89
VUSB on Bottom Layer: 15.75,9.05 22.4,9.05 22.4,7.37 15.75,7.37
VUSB on Bottom Layer: 10.3,15.22 10.33,15.19 10.33,14.02 10.65,13.7 11.76,13.7 12.15,14.09 13.4,14.09 13.4,12.45 13.06,12.11 12.12,12.11 11.76,12.47 11.76,12.61 10.36,12.61 10.26,12.5 9.61,12.5 9.53,12.58 9.53,15.17 9.58,15.22
VUSB on VCC: 15.69,7.93 14.56,9.06 14.56,9.66 11.62,12.6 11.62,14.03 13.24,13.99 13.4,13.37 17.73,9.05 17.9,9.05 17.9,8.01 17.91,8 17.84,7.93
$1N93213 on Bottom Layer: 7.67,15.25 6.54,15.25 5.6,14.3 5.6,12.7 5.65,12.65 6.43,12.65 6.43,13.1 7.21,13.89 7.7,13.89 7.71,13.88 7.71,15.2
$1N93916 on Bottom Layer: 12.14,16.44 12.14,16.97 12.97,16.97 13.03,16.91 13.03,15.46 11.52,13.94 10.92,13.94 10.9,13.93 10.9,15.21
$1N94129 on Top Layer: 9.49,20.52 10.29,20.52 10.29,18.34 9.49,18.34
$1N94139 on Top Layer: 10.98,19.22 12.1,19.22 12.1,16.88 10.98,16.88
$1N175673 on Top Layer: 7.24,10.62 7.24,7.82 7.91,7.14 12.22,7.14 12.92,7.83 12.92,9.31 9.4,11.01 7.63,11.01
$1N175673 on Bottom Layer: 7.07,9.73 7.07,7.79 7.74,7.11 12.06,7.11 12.75,7.8 12.75,9.28 9.23,10.98 8.33,10.98
$1N175673 on Bottom Layer: 7.92,11.74 7.92,9.55 8.12,9.35 9.63,9.35 9.83,9.55 9.83,11.74 9.74,11.83 8.01,11.83

Small or netless copper shapes (teardrops, artwork), in the pictures only: 307 on Top Layer, 197 on Bottom Layer, 16 on VCC

## Text on the board
Top Silkscreen Layer: 5V | TX1 | RX1 | GND | SWDIO | SWCLK | VUSB | VIN | RX3 | TX3 | PA6 | PA5 | PA4 | RX2 | TX2
